# Altium schematic sheet BFMC_FileInfo.SchDoc
size A; SheetNumber: 3; SheetTotal: 7
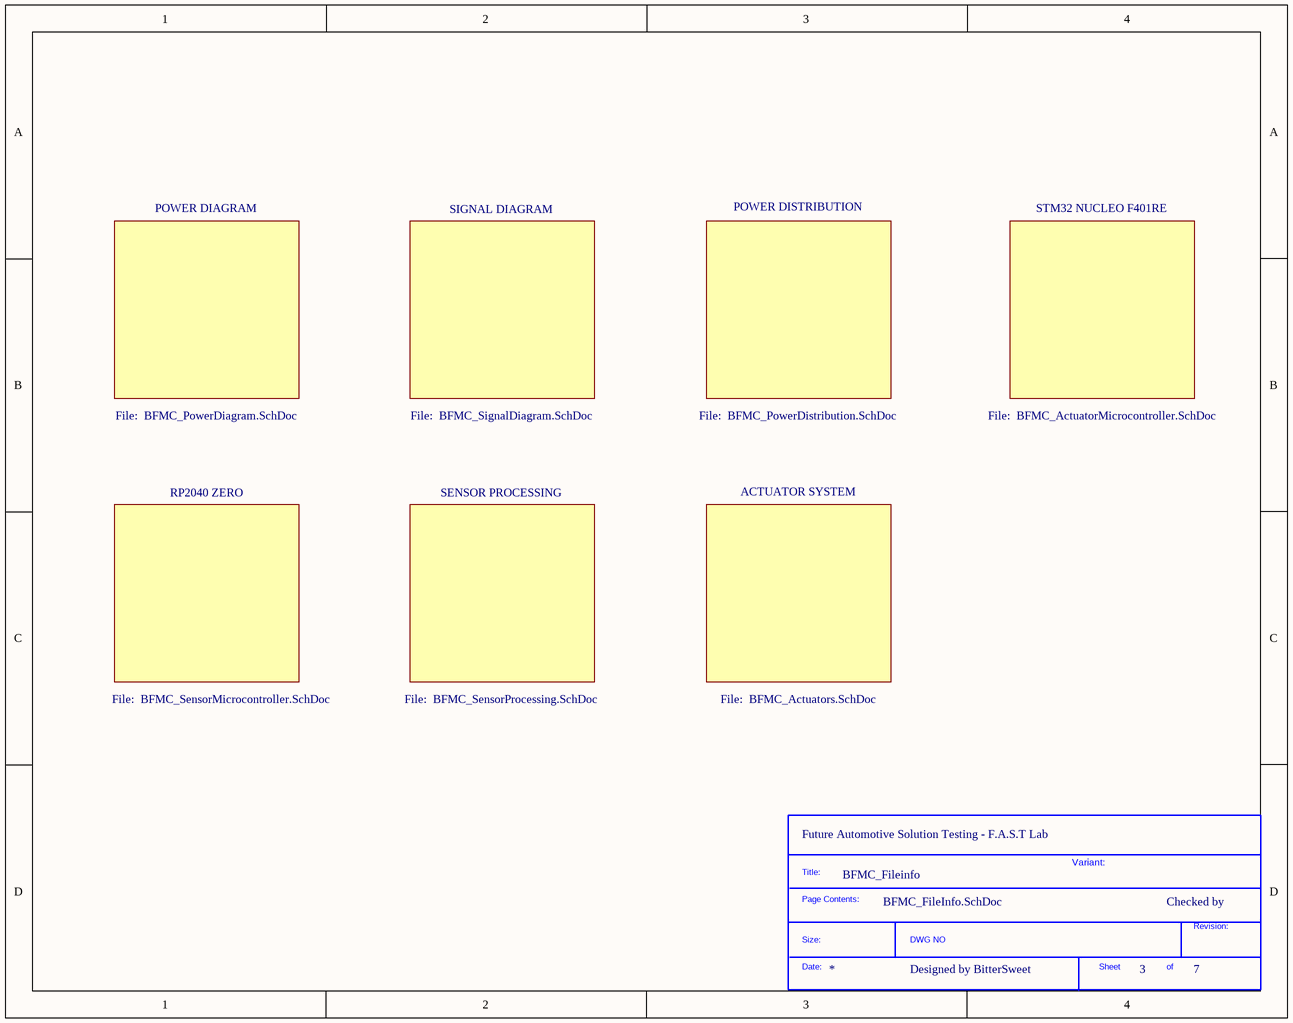
[diagram p0: BFMC_FileInfo.SchDoc]

## Parts
*?  SDTitleBlock  (value not drawn)  (graphical)

## Notes on the sheet
- POWER DIAGRAM
- SIGNAL DIAGRAM
- POWER DISTRIBUTION
- STM32 NUCLEO F401RE
- File:  BFMC_PowerDiagram.SchDoc
- File:  BFMC_SignalDiagram.SchDoc
- File:  BFMC_PowerDistribution.SchDoc
- File:  BFMC_ActuatorMicrocontroller.SchDoc
- RP2040 ZERO
- SENSOR PROCESSING
- ACTUATOR SYSTEM
- File:  BFMC_SensorMicrocontroller.SchDoc
- File:  BFMC_SensorProcessing.SchDoc
- File:  BFMC_Actuators.SchDoc
- (near *?) Future Automotive Solution Testing - F.A.S.T Lab
- BFMC_Fileinfo
- Variant:
- Checked by
- Designed by BitterSweet
- (in symbol SDTitleBlock) Title:; Page Contents:; Revision:; Size:; DWG NO; Date:; Sheet; of